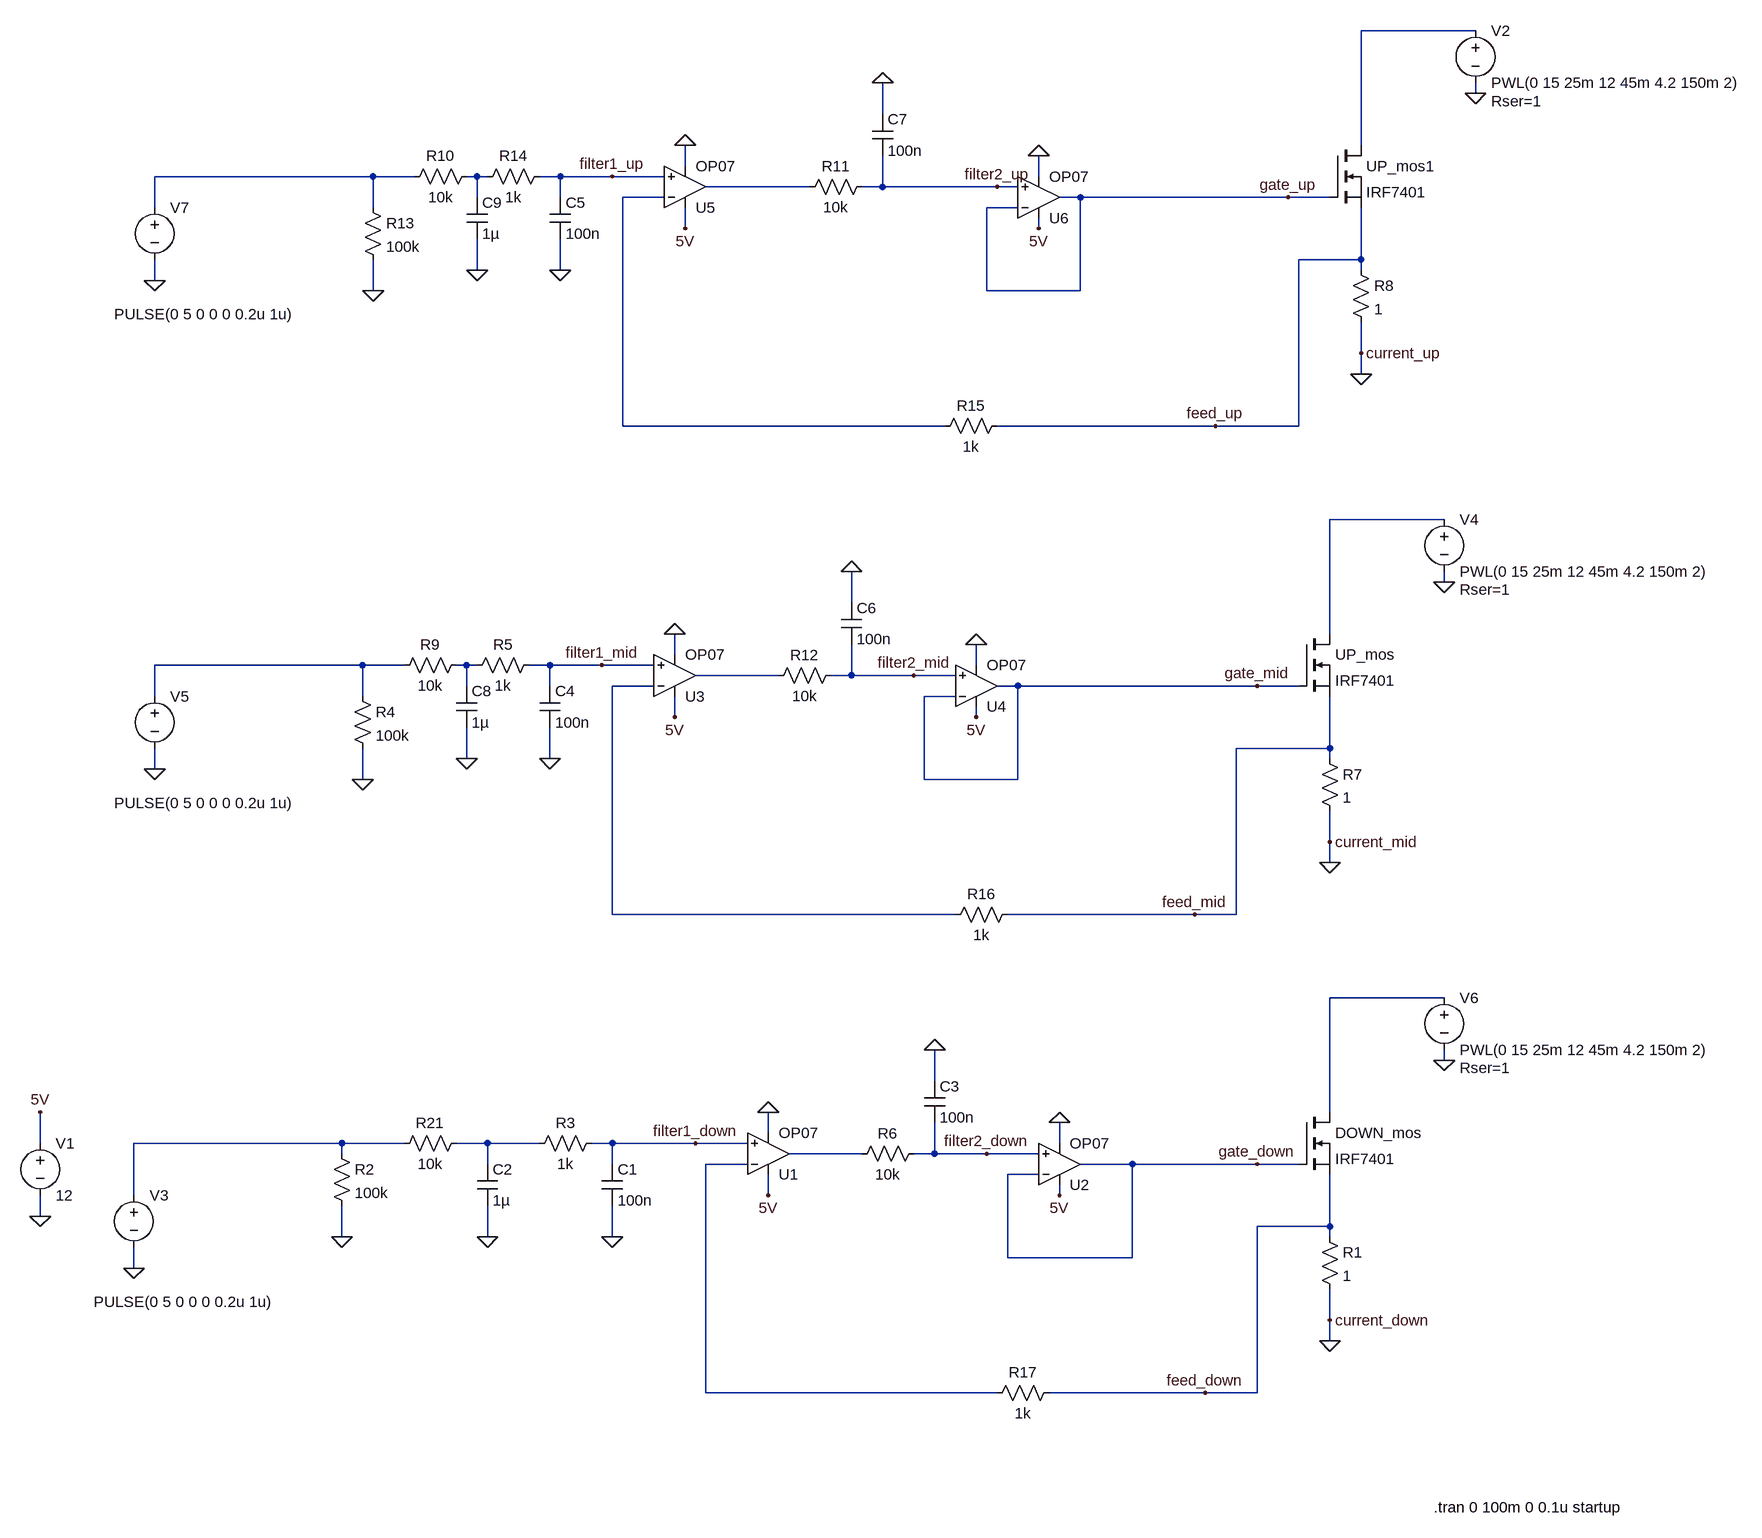
[diagram p0: schematic constant_current.asc]
constant_current.asc, the LTspice schematic file:
Version 4
SHEET 1 880 752
WIRE 384 -1536 208 -1536
WIRE 384 -1440 384 -1456
WIRE -528 -1408 -528 -1456
WIRE 208 -1360 208 -1536
WIRE -832 -1328 -832 -1360
WIRE -1312 -1312 -1648 -1312
WIRE -1248 -1312 -1312 -1312
WIRE -1152 -1312 -1168 -1312
WIRE -1136 -1312 -1152 -1312
WIRE -1024 -1312 -1056 -1312
WIRE -944 -1312 -1024 -1312
WIRE -864 -1312 -944 -1312
WIRE -288 -1312 -288 -1344
WIRE -640 -1296 -800 -1296
WIRE -528 -1296 -528 -1344
WIRE -528 -1296 -560 -1296
WIRE -352 -1296 -528 -1296
WIRE -320 -1296 -352 -1296
WIRE -1152 -1280 -1152 -1312
WIRE -1024 -1280 -1024 -1312
WIRE -864 -1280 -928 -1280
WIRE -224 -1280 -256 -1280
WIRE 96 -1280 -224 -1280
WIRE 160 -1280 96 -1280
WIRE -1648 -1264 -1648 -1312
WIRE -1312 -1264 -1312 -1312
WIRE -320 -1264 -368 -1264
WIRE -832 -1232 -832 -1264
WIRE -288 -1232 -288 -1248
WIRE 208 -1184 208 -1264
WIRE 208 -1184 112 -1184
WIRE -1152 -1168 -1152 -1216
WIRE -1024 -1168 -1024 -1216
WIRE 208 -1168 208 -1184
WIRE -1648 -1152 -1648 -1184
WIRE -1312 -1136 -1312 -1184
WIRE -368 -1136 -368 -1264
WIRE -224 -1136 -224 -1280
WIRE -224 -1136 -368 -1136
WIRE 208 -1040 208 -1088
WIRE 208 -1008 208 -1040
WIRE -928 -928 -928 -1280
WIRE -432 -928 -928 -928
WIRE -16 -928 -352 -928
WIRE 112 -928 112 -1184
WIRE 112 -928 -16 -928
WIRE 336 -784 160 -784
WIRE 336 -688 336 -704
WIRE -576 -656 -576 -704
WIRE 160 -608 160 -784
WIRE -848 -576 -848 -608
WIRE -1328 -560 -1648 -560
WIRE -1264 -560 -1328 -560
WIRE -1168 -560 -1184 -560
WIRE -1152 -560 -1168 -560
WIRE -1040 -560 -1072 -560
WIRE -960 -560 -1040 -560
WIRE -880 -560 -960 -560
WIRE -384 -560 -384 -592
WIRE -688 -544 -816 -544
WIRE -576 -544 -576 -592
WIRE -576 -544 -608 -544
WIRE -480 -544 -576 -544
WIRE -416 -544 -480 -544
WIRE -1168 -528 -1168 -560
WIRE -1040 -528 -1040 -560
WIRE -880 -528 -944 -528
WIRE -320 -528 -352 -528
WIRE 48 -528 -320 -528
WIRE 112 -528 48 -528
WIRE -1648 -512 -1648 -560
WIRE -1328 -512 -1328 -560
WIRE -416 -512 -464 -512
WIRE -848 -480 -848 -512
WIRE -384 -480 -384 -496
WIRE 160 -432 160 -512
WIRE 160 -432 16 -432
WIRE -1168 -416 -1168 -464
WIRE -1040 -416 -1040 -464
WIRE 160 -416 160 -432
WIRE -1648 -400 -1648 -432
WIRE -1328 -384 -1328 -432
WIRE -464 -384 -464 -512
WIRE -320 -384 -320 -528
WIRE -320 -384 -464 -384
WIRE 160 -288 160 -336
WIRE 160 -256 160 -288
WIRE -944 -176 -944 -528
WIRE -416 -176 -944 -176
WIRE -48 -176 -336 -176
WIRE 16 -176 16 -432
WIRE 16 -176 -48 -176
WIRE 336 -48 160 -48
WIRE 336 48 336 32
WIRE -448 80 -448 32
WIRE 160 128 160 -48
WIRE -704 160 -704 128
WIRE -1824 176 -1824 128
WIRE -1360 176 -1680 176
WIRE -1264 176 -1360 176
WIRE -1136 176 -1184 176
WIRE -1056 176 -1136 176
WIRE -944 176 -976 176
WIRE -816 176 -944 176
WIRE -736 176 -816 176
WIRE -256 176 -256 144
WIRE -1360 192 -1360 176
WIRE -560 192 -672 192
WIRE -448 192 -448 144
WIRE -448 192 -480 192
WIRE -368 192 -448 192
WIRE -288 192 -368 192
WIRE -1136 208 -1136 176
WIRE -944 208 -944 176
WIRE -736 208 -800 208
WIRE -144 208 -224 208
WIRE 48 208 -144 208
WIRE 112 208 48 208
WIRE -288 224 -336 224
WIRE -1680 256 -1680 176
WIRE -704 256 -704 224
WIRE -256 256 -256 240
WIRE -1824 288 -1824 256
WIRE 160 304 160 224
WIRE 160 304 48 304
WIRE -1360 320 -1360 272
WIRE -1136 320 -1136 272
WIRE -944 320 -944 272
WIRE 160 320 160 304
WIRE -336 352 -336 224
WIRE -144 352 -144 208
WIRE -144 352 -336 352
WIRE -1680 368 -1680 336
WIRE 160 448 160 400
WIRE 160 480 160 448
WIRE -800 560 -800 208
WIRE -352 560 -800 560
WIRE -32 560 -272 560
WIRE 48 560 48 304
WIRE 48 560 -32 560
FLAG -1680 368 0
FLAG 160 480 0
FLAG 336 48 0
FLAG -944 320 0
FLAG -1824 288 0
FLAG -1824 128 5V
FLAG -704 256 5V
FLAG -256 256 5V
FLAG -704 128 0
FLAG -256 144 0
FLAG -448 32 0
FLAG 160 -256 0
FLAG 336 -688 0
FLAG -1040 -416 0
FLAG -848 -480 5V
FLAG -384 -480 5V
FLAG -848 -608 0
FLAG -384 -592 0
FLAG -576 -704 0
FLAG 48 208 gate_down
FLAG 48 -528 gate_mid
FLAG -816 176 filter1_down
FLAG -368 192 filter2_down
FLAG -480 -544 filter2_mid
FLAG -960 -560 filter1_mid
FLAG 160 448 current_down
FLAG 160 -288 current_mid
FLAG -32 560 feed_down
FLAG -48 -176 feed_mid
FLAG -1648 -400 0
FLAG -1328 -384 0
FLAG -1360 320 0
FLAG 208 -1008 0
FLAG 384 -1440 0
FLAG -832 -1232 5V
FLAG -288 -1232 5V
FLAG -832 -1360 0
FLAG -288 -1344 0
FLAG -528 -1456 0
FLAG 96 -1280 gate_up
FLAG -352 -1296 filter2_up
FLAG -944 -1312 filter1_up
FLAG 208 -1040 current_up
FLAG -16 -928 feed_up
FLAG -1648 -1152 0
FLAG -1136 320 0
FLAG -1168 -416 0
FLAG -1024 -1168 0
FLAG -1312 -1136 0
FLAG -1152 -1168 0
SYMBOL nmos 112 128 R0
SYMATTR InstName DOWN_mos
SYMATTR Value IRF7401
SYMBOL Opamps\\OP07 -704 256 M180
SYMATTR InstName U1
SYMBOL Opamps\\OP07 -256 272 M180
SYMATTR InstName U2
SYMBOL res 144 304 R0
SYMATTR InstName R1
SYMATTR Value 1
SYMATTR SpiceLine pwr=10
SYMBOL voltage -1680 240 R0
WINDOW 123 0 0 Left 0
WINDOW 39 0 0 Left 0
WINDOW 3 -62 180 Left 2
SYMATTR Value PULSE(0 5 0 0 0 0.2u 1u)
SYMATTR InstName V3
SYMBOL res -960 160 R90
WINDOW 0 0 56 VBottom 2
WINDOW 3 32 56 VTop 2
SYMATTR InstName R3
SYMATTR Value 1k
SYMBOL cap -960 208 R0
SYMATTR InstName C1
SYMATTR Value 100n
SYMBOL voltage -1824 160 R0
WINDOW 123 0 0 Left 0
WINDOW 39 0 0 Left 0
SYMATTR InstName V1
SYMATTR Value 12
SYMBOL cap -464 80 R0
SYMATTR InstName C3
SYMATTR Value 100n
SYMBOL res -464 176 R90
WINDOW 0 0 56 VBottom 2
WINDOW 3 32 56 VTop 2
SYMATTR InstName R6
SYMATTR Value 10k
SYMBOL nmos 112 -608 R0
SYMATTR InstName UP_mos
SYMATTR Value IRF7401
SYMBOL Opamps\\OP07 -848 -480 M180
SYMATTR InstName U3
SYMBOL Opamps\\OP07 -384 -464 M180
SYMATTR InstName U4
SYMBOL res 144 -432 R0
SYMATTR InstName R7
SYMATTR Value 1
SYMATTR SpiceLine pwr=10
SYMBOL voltage 336 -800 R0
WINDOW 123 0 0 Left 0
WINDOW 39 24 124 Left 2
SYMATTR SpiceLine Rser=1
SYMATTR InstName V4
SYMATTR Value PWL(0 15 25m 12 45m 4.2 150m 2)
SYMBOL res -1168 -576 R90
WINDOW 0 0 56 VBottom 2
WINDOW 3 32 56 VTop 2
SYMATTR InstName R9
SYMATTR Value 10k
SYMBOL cap -1056 -528 R0
SYMATTR InstName C4
SYMATTR Value 100n
SYMBOL cap -592 -656 R0
SYMATTR InstName C6
SYMATTR Value 100n
SYMBOL res -592 -560 R90
WINDOW 0 0 56 VBottom 2
WINDOW 3 32 56 VTop 2
SYMATTR InstName R12
SYMATTR Value 10k
SYMBOL voltage -1648 -528 R0
WINDOW 123 0 0 Left 0
WINDOW 39 0 0 Left 0
WINDOW 3 -62 180 Left 2
SYMATTR Value PULSE(0 5 0 0 0 0.2u 1u)
SYMATTR InstName V5
SYMBOL res -1376 176 R0
SYMATTR InstName R2
SYMATTR Value 100k
SYMBOL res -1344 -528 R0
SYMATTR InstName R4
SYMATTR Value 100k
SYMBOL nmos 160 -1360 R0
SYMATTR InstName UP_mos1
SYMATTR Value IRF7401
SYMBOL Opamps\\OP07 -832 -1232 M180
SYMATTR InstName U5
SYMBOL Opamps\\OP07 -288 -1216 M180
SYMATTR InstName U6
SYMBOL res 192 -1184 R0
SYMATTR InstName R8
SYMATTR Value 1
SYMATTR SpiceLine pwr=10
SYMBOL cap -544 -1408 R0
SYMATTR InstName C7
SYMATTR Value 100n
SYMBOL res -544 -1312 R90
WINDOW 0 0 56 VBottom 2
WINDOW 3 32 56 VTop 2
SYMATTR InstName R11
SYMATTR Value 10k
SYMBOL voltage -1648 -1280 R0
WINDOW 123 0 0 Left 0
WINDOW 39 0 0 Left 0
WINDOW 3 -62 180 Left 2
SYMATTR Value PULSE(0 5 0 0 0 0.2u 1u)
SYMATTR InstName V7
SYMBOL voltage 384 -1552 R0
WINDOW 123 0 0 Left 0
WINDOW 39 24 124 Left 2
SYMATTR SpiceLine Rser=1
SYMATTR InstName V2
SYMATTR Value PWL(0 15 25m 12 45m 4.2 150m 2)
SYMBOL voltage 336 -64 R0
WINDOW 123 0 0 Left 0
WINDOW 39 24 124 Left 2
SYMATTR SpiceLine Rser=1
SYMATTR InstName V6
SYMATTR Value PWL(0 15 25m 12 45m 4.2 150m 2)
SYMBOL res -1168 160 R90
WINDOW 0 0 56 VBottom 2
WINDOW 3 32 56 VTop 2
SYMATTR InstName R21
SYMATTR Value 10k
SYMBOL cap -1152 208 R0
SYMATTR InstName C2
SYMATTR Value 1µ
SYMBOL res -1056 -576 R90
WINDOW 0 0 56 VBottom 2
WINDOW 3 32 56 VTop 2
SYMATTR InstName R5
SYMATTR Value 1k
SYMBOL cap -1184 -528 R0
SYMATTR InstName C8
SYMATTR Value 1µ
SYMBOL res -1152 -1328 R90
WINDOW 0 0 56 VBottom 2
WINDOW 3 32 56 VTop 2
SYMATTR InstName R10
SYMATTR Value 10k
SYMBOL cap -1040 -1280 R0
SYMATTR InstName C5
SYMATTR Value 100n
SYMBOL res -1328 -1280 R0
SYMATTR InstName R13
SYMATTR Value 100k
SYMBOL res -1040 -1328 R90
WINDOW 0 0 56 VBottom 2
WINDOW 3 32 56 VTop 2
SYMATTR InstName R14
SYMATTR Value 1k
SYMBOL cap -1168 -1280 R0
SYMATTR InstName C9
SYMATTR Value 1µ
SYMBOL res -336 -944 R90
WINDOW 0 0 56 VBottom 2
WINDOW 3 32 56 VTop 2
SYMATTR InstName R15
SYMATTR Value 1k
SYMBOL res -320 -192 R90
WINDOW 0 0 56 VBottom 2
WINDOW 3 32 56 VTop 2
SYMATTR InstName R16
SYMATTR Value 1k
SYMBOL res -256 544 R90
WINDOW 0 0 56 VBottom 2
WINDOW 3 32 56 VTop 2
SYMATTR InstName R17
SYMATTR Value 1k
TEXT 320 736 Left 2 !.tran 0 100m 0 0.1u startup

The netlist it stands for:
* constant_current.asc
M§DOWN_mos N011 gate_down feed_down feed_down IRF7401
XU1 filter1_down N015 5V 0 N014 LT1001  ; OP07, pins In+ In- V+ V- OUT
XU2 filter2_down gate_down 5V 0 gate_down LT1001  ; OP07, pins In+ In- V+ V- OUT
R1 feed_down 0 1 pwr=10
V3 N012 0 PULSE(0 5 0 0 0 0.2u 1u)
R3 filter1_down N013 1k
C1 filter1_down 0 100n
V1 5V 0 12
C3 0 filter2_down 100n
R6 filter2_down N014 10k
M§UP_mos N006 gate_mid feed_mid feed_mid IRF7401
XU3 filter1_mid N010 5V 0 N009 LT1001  ; OP07, pins In+ In- V+ V- OUT
XU4 filter2_mid gate_mid 5V 0 gate_mid LT1001  ; OP07, pins In+ In- V+ V- OUT
R7 feed_mid 0 1 pwr=10
V4 N006 0 PWL(0 15 25m 12 45m 4.2 150m 2) Rser=1
R9 N008 N007 10k
C4 filter1_mid 0 100n
C6 0 filter2_mid 100n
R12 filter2_mid N009 10k
V5 N007 0 PULSE(0 5 0 0 0 0.2u 1u)
R2 N012 0 100k
R4 N007 0 100k
M§UP_mos1 N001 gate_up feed_up feed_up IRF7401
XU5 filter1_up N005 5V 0 N004 LT1001  ; OP07, pins In+ In- V+ V- OUT
XU6 filter2_up gate_up 5V 0 gate_up LT1001  ; OP07, pins In+ In- V+ V- OUT
R8 feed_up 0 1 pwr=10
C7 0 filter2_up 100n
R11 filter2_up N004 10k
V7 N002 0 PULSE(0 5 0 0 0 0.2u 1u)
V2 N001 0 PWL(0 15 25m 12 45m 4.2 150m 2) Rser=1
V6 N011 0 PWL(0 15 25m 12 45m 4.2 150m 2) Rser=1
R21 N013 N012 10k
C2 N013 0 1µ
R5 filter1_mid N008 1k
C8 N008 0 1µ
R10 N003 N002 10k
C5 filter1_up 0 100n
R13 N002 0 100k
R14 filter1_up N003 1k
C9 N003 0 1µ
R15 feed_up N005 1k
R16 feed_mid N010 1k
R17 feed_down N015 1k
.model NMOS NMOS
.model PMOS PMOS
.lib standard.mos
.tran 0 100m 0 0.1u startup
.lib LTC.lib
.backanno
.end